# Altium schematic sheet MCU_Sensors_CAN.SchDoc
size 431 x 279 mm; SheetNumber: 6; SheetTotal: 8
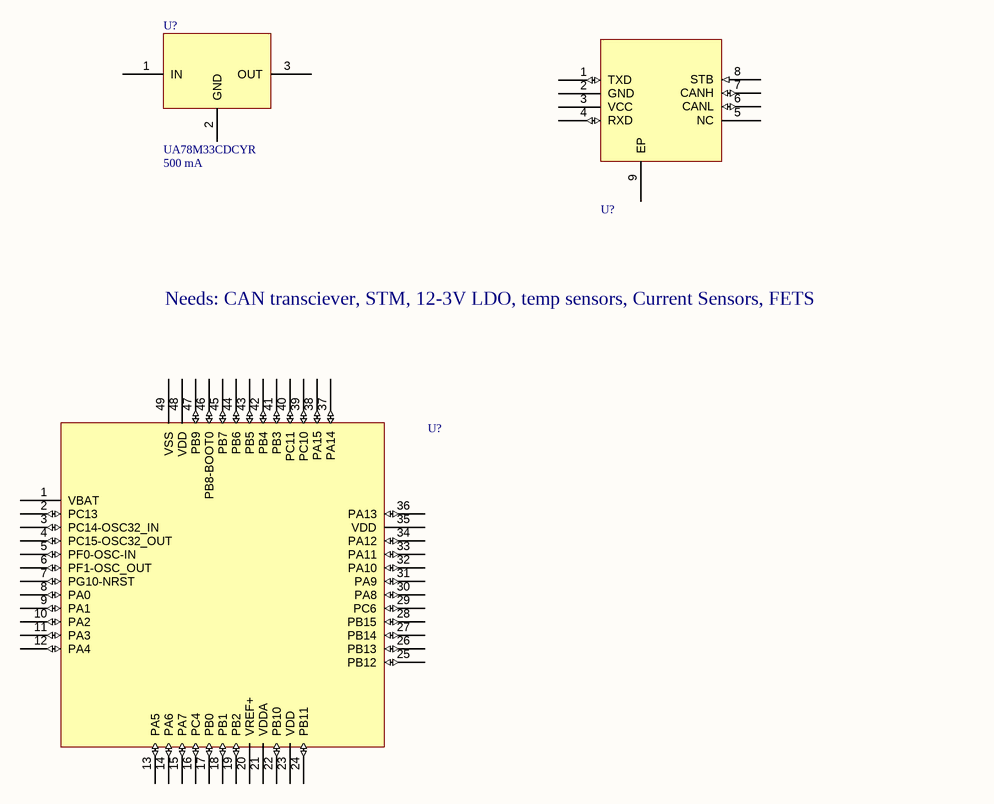
[diagram p0: MCU_Sensors_CAN.SchDoc]

## Parts
(Parts that share a designator on the sheet are numbered #1, #2 ... from top to bottom, then left to right.)
U?#1  TCAN1042HGDRBTQ1  [IC-8-VSON]  (value not drawn)
U?#2  UA78M33CDCYR  Current: 500 mA  [IC-SOT-223-4]
U?#3  STM32G431CBU6  [MCU-UFQFPN48]  (value not drawn)

## Nets

Not connected (* = marked no-connect by the designer): U?#1 1(TXD) 2(GND) 3(VCC) 4(RXD) 5(NC) 6(CANL) 7(CANH) 8(STB) 9(EP); U?#2 1(IN) 2(GND) 3(OUT); U?#3 1(VBAT) 2(PC13) 3(PC14-OSC32_IN) 4(PC15-OSC32_OUT) 5(PF0-OSC-IN) 6(PF1-OSC_OUT) 7(PG10-NRST) 8(PA0) 9(PA1) 10(PA2) 11(PA3) 12(PA4) 13(PA5) 14(PA6) 15(PA7) 16(PC4) 17(PB0) 18(PB1) 19(PB2) 20(VREF+) 21(VDDA) 22(PB10) 23(VDD) 24(PB11) 25(PB12) 26(PB13) 27(PB14) 28(PB15) 29(PC6) 30(PA8) 31(PA9) 32(PA10) 33(PA11) 34(PA12) 35(VDD) 36(PA13) 37(PA14) 38(PA15) 39(PC10) 40(PC11) 41(PB3) 42(PB4) 43(PB5) 44(PB6) 45(PB7) 46(PB8-BOOT0) 47(PB9) 48(VDD) 49(VSS)

## Notes on the sheet
- Needs: CAN transciever, STM, 12-3V LDO, temp sensors, Current Sensors, FETS
- DWG. NO.
- REV.
- SHT.
- THIS DOCUMENT AND THE DATA DISCLOSED HEREIN OR HEREWITH IS THE PROPERTY OF ALTIUM LIMITED AND MAY BE FREELY DISTRIBUTED IN WHOLE. NO RIGHTS ARE RESERVED OR EXPRESS OR IMPLIED WARANTEE GIVEN.
- REVISION
- DESCRIPTION
- DATE
- APPROVED
- ENG:
- APPROVALS
- PROJECT
- DSN:
- CHK:
- REFERENCE DOCUMENTS
- PROJECT REVISION:
- TITLE
- DOCUMENT REVISION:
- DESIGN ITEM:
- BOM:
- FAB DWG:
- PCB DWG:
- ASSY DWG:
- SCALE:
- SIZE
- B
- CAGE CODE
- FILE NAME
- DWG NO.
- SHEET
- OF
- REV

## Library data of the parts
U?#1 = IC-CAN-TRANSCEIVER-0002: 1/1 Transceiver CANbus 8-VSON (3x3); Manufacturer: Texas Instrument; CAN Capability: FD-CAN; Manufacturer Part Number: TCAN1042HGDRBTQ1
U?#2 = IC-LDO-3.3V-0002: Linear Voltage Regulator IC Positive Fixed 1 Output 500mA SOT-223-4; Vin: 25V; Vout: 3.3V; Package: SOT-223-4
U?#3 = IC-STM32G431CBU6: 128KB 1.71V~3.6V ARM-MSeries 32KB 170MHz FLASH 42 UFQFPN-48(7x7) Microcontroller Units (MCUs/MPUs/SOCs) ROHS; Assembled?: no; Manufacturer Part Number: STM32G431CBU6; Package: UFQFPN-48